# EAGLE design KitchenLightsController (EAGLE 7.4.0)
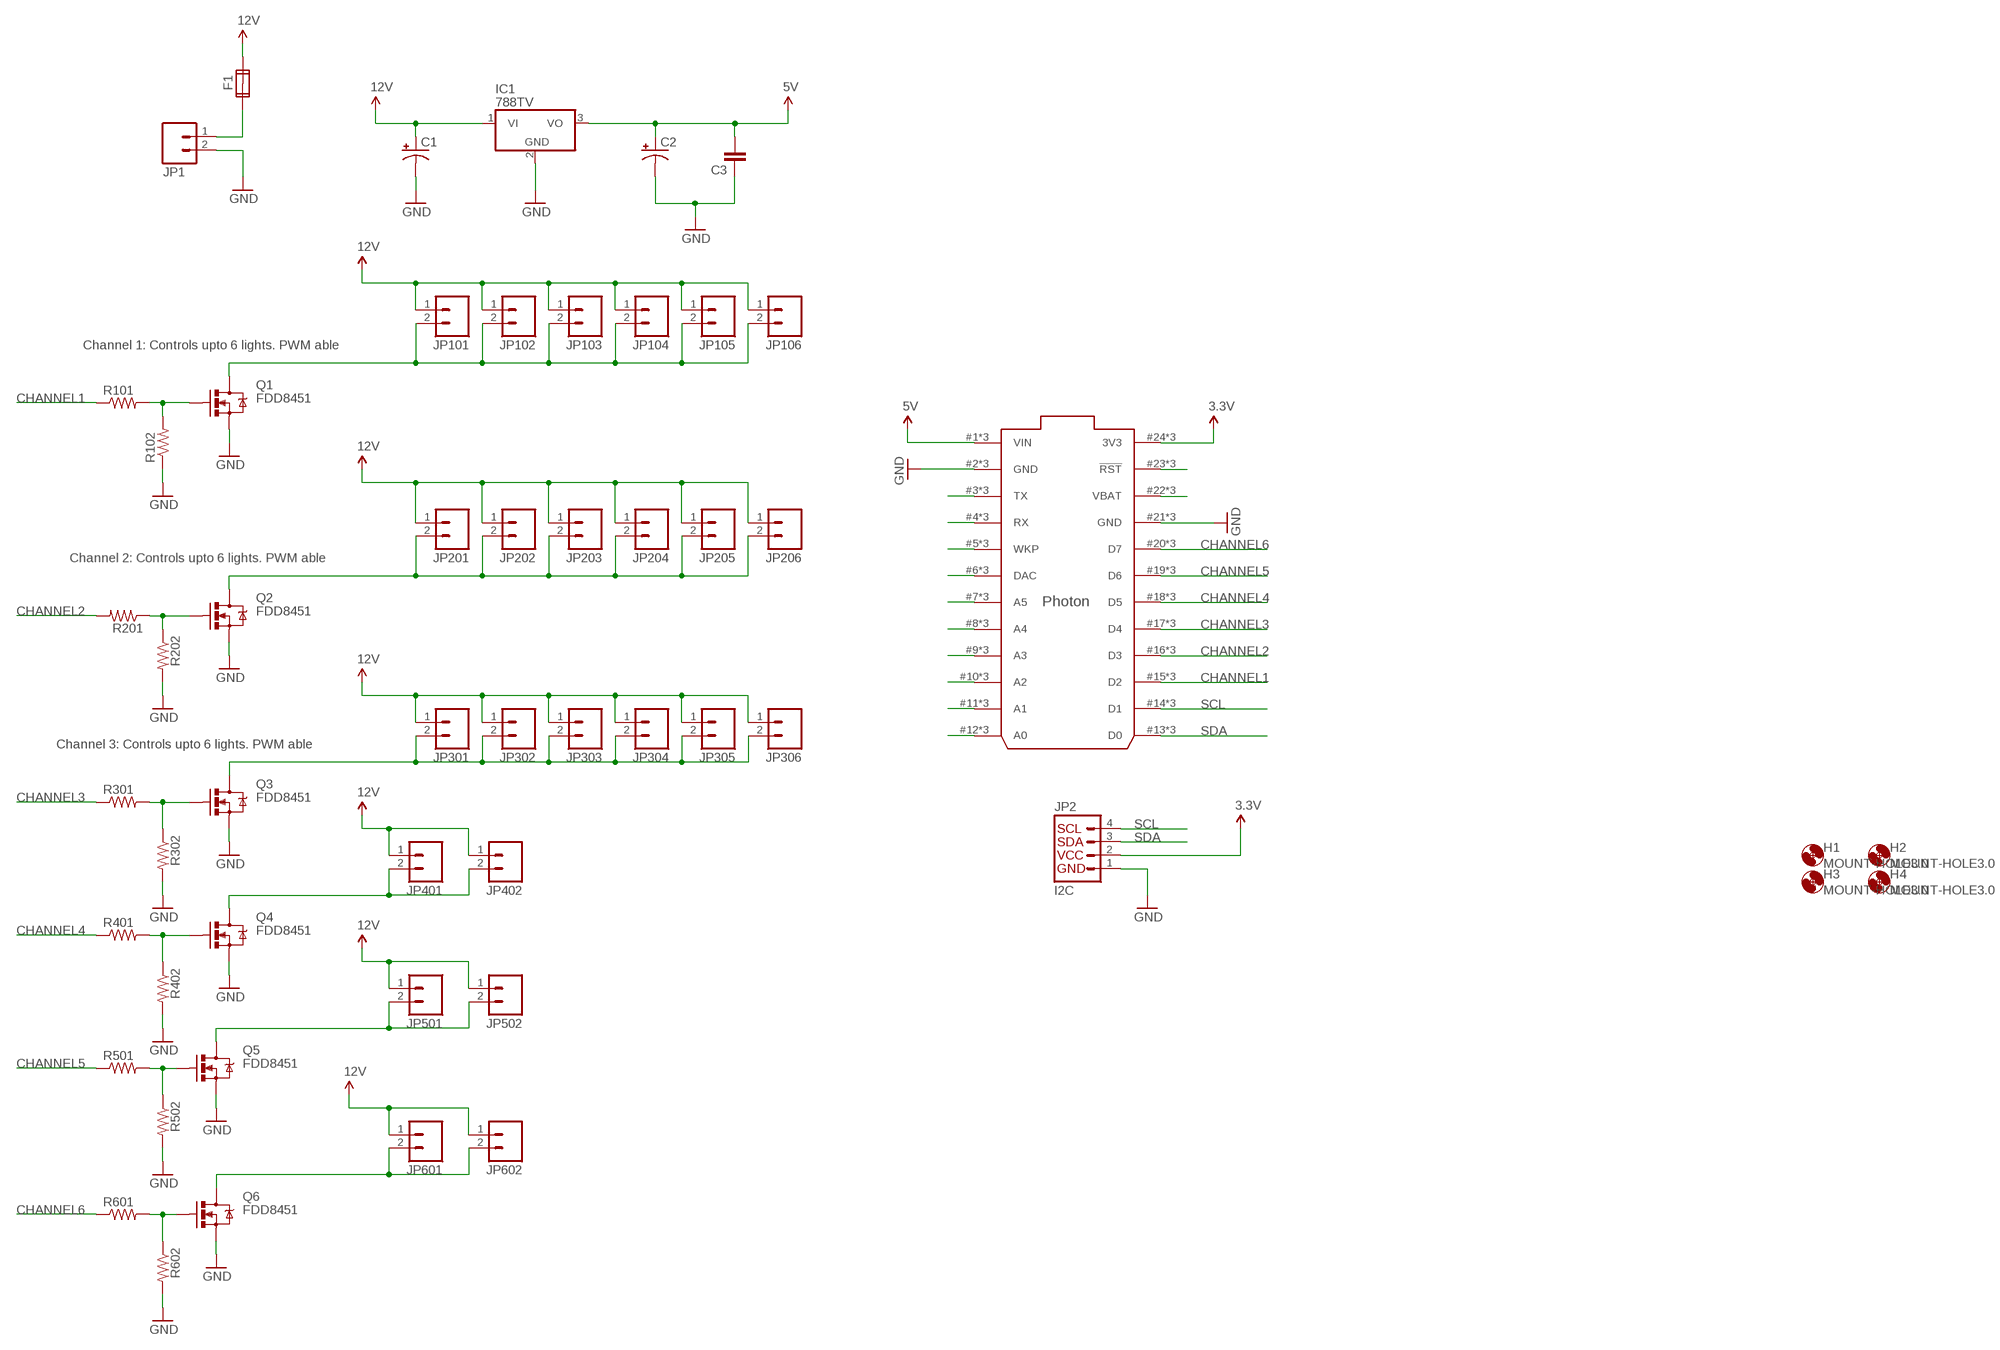
[diagram p0: schematic, sheet 1, part 1 of 2]
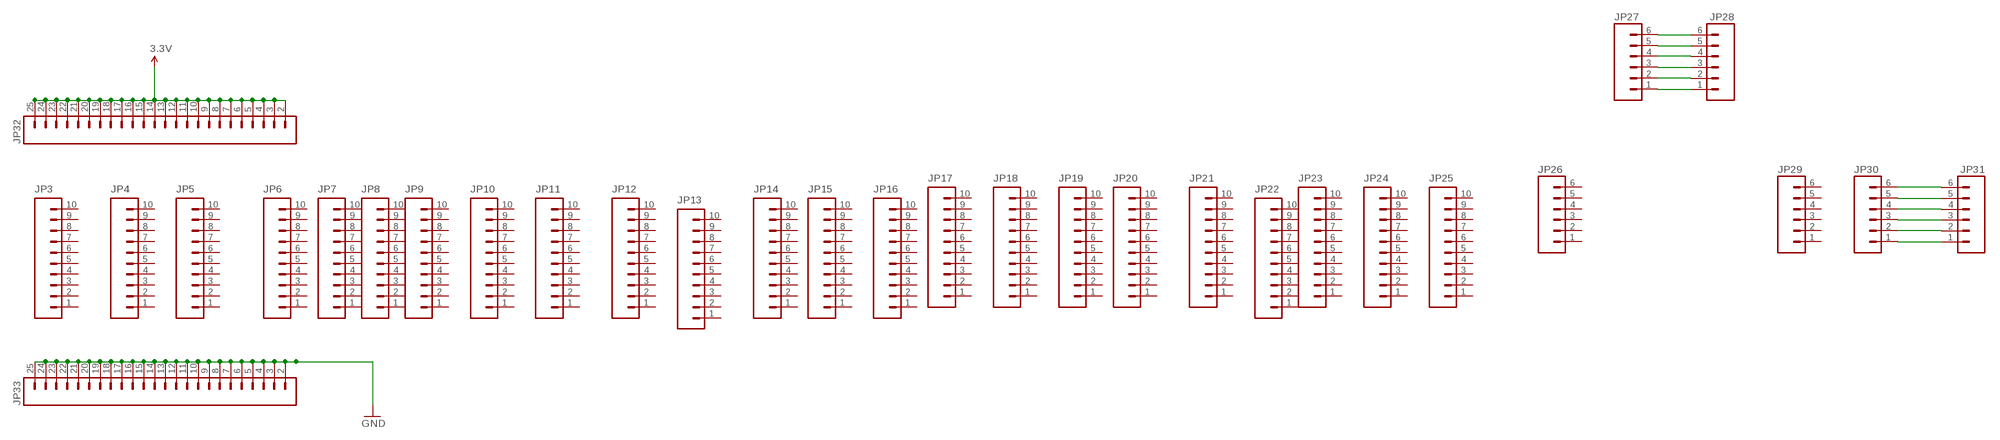
[diagram p1: schematic, sheet 1, part 2 of 2]

## Parts
C1  10UF-25V-20%(PTH)  [CPOL-RADIAL-10UF-25V]
C2  10UF-25V-20%(PTH)  [CPOL-RADIAL-10UF-25V]
C3  1UF-25V-10%(0805)"  [0805-CAP]
F1  FUSE2P  [FUSE1]
H1  MOUNT-HOLE3.0  [3,0]
H2  MOUNT-HOLE3.0  [3,0]
H3  MOUNT-HOLE3.0  [3,0]
H4  MOUNT-HOLE3.0  [3,0]
IC1  788TV  [TO220V]
JP1  M023.5MM  [SCREWTERMINAL-3.5MM-2]
JP2  I2C  I2C_STANDARD  [1X04]
JP3  M10NO_SILK_PTH_FEMALE  [1X10_NO_SILK]
JP4  M10NO_SILK_PTH_FEMALE  [1X10_NO_SILK]
JP5  M10NO_SILK_PTH_FEMALE  [1X10_NO_SILK]
JP6  M10NO_SILK_PTH_FEMALE  [1X10_NO_SILK]
JP7  M10NO_SILK_PTH_FEMALE  [1X10_NO_SILK]
JP8  M10NO_SILK_PTH_FEMALE  [1X10_NO_SILK]
JP9  M10NO_SILK_PTH_FEMALE  [1X10_NO_SILK]
JP10  M10NO_SILK_PTH_FEMALE  [1X10_NO_SILK]
JP11  M10NO_SILK_PTH_FEMALE  [1X10_NO_SILK]
JP12  M10NO_SILK_PTH_FEMALE  [1X10_NO_SILK]
JP13  M10NO_SILK_PTH_FEMALE  [1X10_NO_SILK]
JP14  M10NO_SILK_PTH_FEMALE  [1X10_NO_SILK]
JP15  M10NO_SILK_PTH_FEMALE  [1X10_NO_SILK]
JP16  M10NO_SILK_PTH_FEMALE  [1X10_NO_SILK]
JP17  M10NO_SILK_PTH_FEMALE  [1X10_NO_SILK]
JP18  M10NO_SILK_PTH_FEMALE  [1X10_NO_SILK]
JP19  M10NO_SILK_PTH_FEMALE  [1X10_NO_SILK]
JP20  M10NO_SILK_PTH_FEMALE  [1X10_NO_SILK]
JP21  M10NO_SILK_PTH_FEMALE  [1X10_NO_SILK]
JP22  M10NO_SILK_PTH_FEMALE  [1X10_NO_SILK]
JP23  M10NO_SILK_PTH_FEMALE  [1X10_NO_SILK]
JP24  M10NO_SILK_PTH_FEMALE  [1X10_NO_SILK]
JP25  M10NO_SILK_PTH_FEMALE  [1X10_NO_SILK]
JP26  M06NO_SILK_FEMALE_PTH  [1X06_NO_SILK]
JP27  M06NO_SILK_FEMALE_PTH  [1X06_NO_SILK]
JP28  M06NO_SILK_FEMALE_PTH  [1X06_NO_SILK]
JP29  M06NO_SILK_FEMALE_PTH  [1X06_NO_SILK]
JP30  M06NO_SILK_FEMALE_PTH  [1X06_NO_SILK]
JP31  M06NO_SILK_FEMALE_PTH  [1X06_NO_SILK]
JP32  M24  [1X24]
JP33  M24  [1X24]
JP101  M02POLAR  [MOLEX-1X2]
JP102  M02POLAR  [MOLEX-1X2]
JP103  M02POLAR  [MOLEX-1X2]
JP104  M02POLAR  [MOLEX-1X2]
JP105  M02POLAR  [MOLEX-1X2]
JP106  M02POLAR  [MOLEX-1X2]
JP201  M02POLAR  [MOLEX-1X2]
JP202  M02POLAR  [MOLEX-1X2]
JP203  M02POLAR  [MOLEX-1X2]
JP204  M02POLAR  [MOLEX-1X2]
JP205  M02POLAR  [MOLEX-1X2]
JP206  M02POLAR  [MOLEX-1X2]
JP301  M02POLAR  [MOLEX-1X2]
JP302  M02POLAR  [MOLEX-1X2]
JP303  M02POLAR  [MOLEX-1X2]
JP304  M02POLAR  [MOLEX-1X2]
JP305  M02POLAR  [MOLEX-1X2]
JP306  M02POLAR  [MOLEX-1X2]
JP401  M02POLAR  [MOLEX-1X2]
JP402  M023.5MM  [SCREWTERMINAL-3.5MM-2]
JP501  M02POLAR  [MOLEX-1X2]
JP502  M023.5MM  [SCREWTERMINAL-3.5MM-2]
JP601  M02POLAR  [MOLEX-1X2]
JP602  M023.5MM  [SCREWTERMINAL-3.5MM-2]
Q1  FDD8451  MOSFET-NCHANNELFDD8780  [DPAK]
Q2  FDD8451  MOSFET-NCHANNELFDD8780  [DPAK]
Q3  FDD8451  MOSFET-NCHANNELFDD8780  [DPAK]
Q4  FDD8451  MOSFET-NCHANNELFDD8780  [DPAK]
Q5  FDD8451  MOSFET-NCHANNELFDD8780  [DPAK]
Q6  FDD8451  MOSFET-NCHANNELFDD8780  [DPAK]
R101  RESISTOR0805-RES  [0805]
R102  RESISTOR0805-RES  [0805]
R201  RESISTOR0805-RES  [0805]
R202  RESISTOR0805-RES  [0805]
R301  RESISTOR0805-RES  [0805]
R302  RESISTOR0805-RES  [0805]
R401  RESISTOR0805-RES  [0805]
R402  RESISTOR0805-RES  [0805]
R501  RESISTOR0805-RES  [0805]
R502  RESISTOR0805-RES  [0805]
R601  RESISTOR0805-RES  [0805]
R602  RESISTOR0805-RES  [0805]
U$1  PHOTON_WITH_STACKABLE_HEADERS  [PHOTON_STACKABLE]

## Nets
3.3V: JP2.2 JP32.2 JP32.3 JP32.4 JP32.5 JP32.6 JP32.7 JP32.8 JP32.9 JP32.10 JP32.11 JP32.12 JP32.13 JP32.14 JP32.15 JP32.16 JP32.17 JP32.18 JP32.19 JP32.20 JP32.21 JP32.22 JP32.23 JP32.24 JP32.25 U$1.24(3V3) U$1.#24(3V3) U$1.@24(3V3)
5V: C2.1(+) C3.2 IC1.3(VO) U$1.1(VIN) U$1.#1(VIN) U$1.@1(VIN)
12V: C1.1(+) F1.2A IC1.1(VI) JP101.1 JP102.1 JP103.1 JP104.1 JP105.1 JP106.1 JP201.1 JP202.1 JP203.1 JP204.1 JP205.1 JP206.1 JP301.1 JP302.1 JP303.1 JP304.1 JP305.1 JP306.1 JP401.1 JP402.1 JP501.1 JP502.1 JP601.1 JP602.1
CHANNEL1: R101.1 U$1.15(D2) U$1.#15(D2) U$1.@15(D2)
CHANNEL2: R201.2 U$1.16(D3) U$1.#16(D3) U$1.@16(D3)
CHANNEL3: R301.1 U$1.17(D4) U$1.#17(D4) U$1.@17(D4)
CHANNEL4: R401.1 U$1.18(D5) U$1.#18(D5) U$1.@18(D5)
CHANNEL5: R501.1 U$1.19(D6) U$1.#19(D6) U$1.@19(D6)
CHANNEL6: R601.1 U$1.20(D7) U$1.#20(D7) U$1.@20(D7)
GND: C1.2(-) C2.2(-) C3.1 IC1.2(GND) JP1.2 JP2.1 JP33.2 JP33.3 JP33.4 JP33.5 JP33.6 JP33.7 JP33.8 JP33.9 JP33.10 JP33.11 JP33.12 JP33.13 JP33.14 JP33.15 JP33.16 JP33.17 JP33.18 JP33.19 JP33.20 JP33.21 JP33.22 JP33.23 JP33.24 JP33.25 Q1.3(S) Q2.3(S) Q3.3(S) Q4.3(S) Q5.3(S) Q6.3(S) R102.1 R202.2 R302.2 R402.2 R502.2 R602.2 U$1.2(GND) U$1.21(GND) U$1.#2(GND) U$1.#21(GND) U$1.@2(GND) U$1.@21(GND)
N$1: Q1.1(G) R101.2 R102.2
N$2: Q2.1(G) R201.1 R202.1
N$3: Q3.1(G) R301.2 R302.1
N$4: Q4.1(G) R401.2 R402.1
N$5: U$1.23(!RST) U$1.#23(!RST) U$1.@23(!RST)
N$6: U$1.22(VBAT) U$1.#22(VBAT) U$1.@22(VBAT)
N$7: Q5.1(G) R501.2 R502.1
N$8: Q6.1(G) R601.2 R602.1
N$9: JP201.2 JP202.2 JP203.2 JP204.2 JP205.2 JP206.2 Q2.4(D)
N$10: JP101.2 JP102.2 JP103.2 JP104.2 JP105.2 JP106.2 Q1.4(D)
N$11: F1.1A JP1.1
N$14: JP27.1 JP28.1
N$15: U$1.12(A0) U$1.#12(A0) U$1.@12(A0)
N$16: U$1.11(A1) U$1.#11(A1) U$1.@11(A1)
N$17: U$1.10(A2) U$1.#10(A2) U$1.@10(A2)
N$18: U$1.9(A3) U$1.#9(A3) U$1.@9(A3)
N$19: U$1.8(A4) U$1.#8(A4) U$1.@8(A4)
N$20: U$1.7(A5) U$1.#7(A5) U$1.@7(A5)
N$21: U$1.6(DAC) U$1.#6(DAC) U$1.@6(DAC)
N$22: U$1.5(WKP) U$1.#5(WKP) U$1.@5(WKP)
N$23: U$1.4(RX) U$1.#4(RX) U$1.@4(RX)
N$24: U$1.3(TX) U$1.#3(TX) U$1.@3(TX)
N$25: JP27.2 JP28.2
N$26: JP27.3 JP28.3
N$27: JP27.4 JP28.4
N$28: JP301.2 JP302.2 JP303.2 JP304.2 JP305.2 JP306.2 Q3.4(D)
N$29: JP27.5 JP28.5
N$30: JP401.2 JP402.2 Q4.4(D)
N$31: JP501.2 JP502.2 Q5.4(D)
N$32: JP601.2 JP602.2 Q6.4(D)
N$33: JP27.6 JP28.6
N$34: JP30.1 JP31.1
N$35: JP30.2 JP31.2
N$36: JP30.3 JP31.3
N$37: JP30.4 JP31.4
N$38: JP30.5 JP31.5
N$39: JP30.6 JP31.6
SCL: JP2.4 U$1.14(D1) U$1.#14(D1) U$1.@14(D1)
SDA: JP2.3 U$1.13(D0) U$1.#13(D0) U$1.@13(D0)
Unconnected: F1.1B F1.2B JP3.1 JP3.2 JP3.3 JP3.4 JP3.5 JP3.6 JP3.7 JP3.8 JP3.9 JP3.10 JP4.1 JP4.2 JP4.3 JP4.4 JP4.5 JP4.6 JP4.7 JP4.8 JP4.9 JP4.10 JP5.1 JP5.2 JP5.3 JP5.4 JP5.5 JP5.6 JP5.7 JP5.8 JP5.9 JP5.10 JP6.1 JP6.2 JP6.3 JP6.4 JP6.5 JP6.6 JP6.7 JP6.8 JP6.9 JP6.10 JP7.1 JP7.2 JP7.3 JP7.4 JP7.5 JP7.6 JP7.7 JP7.8 JP7.9 JP7.10 JP8.1 JP8.2 JP8.3 JP8.4 JP8.5 JP8.6 JP8.7 JP8.8 JP8.9 JP8.10 JP9.1 JP9.2 JP9.3 JP9.4 JP9.5 JP9.6 JP9.7 JP9.8 JP9.9 JP9.10 JP10.1 JP10.2 JP10.3 JP10.4 JP10.5 JP10.6 JP10.7 JP10.8 JP10.9 JP10.10 JP11.1 JP11.2 JP11.3 JP11.4 JP11.5 JP11.6 JP11.7 JP11.8 JP11.9 JP11.10 JP12.1 JP12.2 JP12.3 JP12.4 JP12.5 JP12.6 JP12.7 JP12.8 JP12.9 JP12.10 JP13.1 JP13.2 JP13.3 JP13.4 JP13.5 JP13.6 JP13.7 JP13.8 JP13.9 JP13.10 JP14.1 JP14.2 JP14.3 JP14.4 JP14.5 JP14.6 JP14.7 JP14.8 JP14.9 JP14.10 JP15.1 JP15.2 JP15.3 JP15.4 JP15.5 JP15.6 JP15.7 JP15.8 JP15.9 JP15.10 JP16.1 JP16.2 JP16.3 JP16.4 JP16.5 JP16.6 JP16.7 JP16.8 JP16.9 JP16.10 JP17.1 JP17.2 JP17.3 JP17.4 JP17.5 JP17.6 JP17.7 JP17.8 JP17.9 JP17.10 JP18.1 JP18.2 JP18.3 JP18.4 JP18.5 JP18.6 JP18.7 JP18.8 JP18.9 JP18.10 JP19.1 JP19.2 JP19.3 JP19.4 JP19.5 JP19.6 JP19.7 JP19.8 JP19.9 JP19.10 JP20.1 JP20.2 JP20.3 JP20.4 JP20.5 JP20.6 JP20.7 JP20.8 JP20.9 JP20.10 JP21.1 JP21.2 JP21.3 JP21.4 JP21.5 JP21.6 JP21.7 JP21.8 JP21.9 JP21.10 JP22.1 JP22.2 JP22.3 JP22.4 JP22.5 JP22.6 JP22.7 JP22.8 JP22.9 JP22.10 JP23.1 JP23.2 JP23.3 JP23.4 JP23.5 JP23.6 JP23.7 JP23.8 JP23.9 JP23.10 JP24.1 JP24.2 JP24.3 JP24.4 JP24.5 JP24.6 JP24.7 JP24.8 JP24.9 JP24.10 JP25.1 JP25.2 JP25.3 JP25.4 JP25.5 JP25.6 JP25.7 JP25.8 JP25.9 JP25.10 JP26.1 JP26.2 JP26.3 JP26.4 JP26.5 JP26.6 JP29.1 JP29.2 JP29.3 JP29.4 JP29.5 JP29.6

## Notes on the sheet
- Channel 1: Controls upto 6 lights. PWM able
- Channel 2: Controls upto 6 lights. PWM able
- Channel 3: Controls upto 6 lights. PWM able

## Library data of the parts
C1 C2 = SparkFun-Capacitors:10UF-25V-20%(PTH): CAP-08440; PROD_ID: CAP-08440
C3 = SparkFun-Capacitors:1UF-25V-10%(0805): CAP-08064
F1 = special:FUSE2P: FUSE 5 x 20 mm
H1-H4 = holes:MOUNT-HOLE: MOUNTING HOLE with drill center marker
IC1 = linear:78*: Positive VOLTAGE REGULATOR Source: http://cache.national.com/ds/LM/LM78L05.pdf http://www.fairchildsemi.com/ds/LM/LM7805.pdf
JP1 JP402 JP502 JP602 = SparkFun-Connectors:M02: Standard 2-pin 0.1" header. Use with - straight break away headers ( PRT-00116) - right angle break away headers (PRT-00553) - swiss pins (PRT-00743) - machine pins (PRT-00117) - female headers (PRT-00115) Molex polarized connector foot print use with: PRT-08233 with associated crimp pins and housings. 2.54_SCREWTERM for use with PRT-10571. 3.5mm Screw Terminal footprints for PRT-08084 5mm Screw Terminal footprints for use with PRT-08432; PROD_ID: CONN-08399
JP2 = SparkFun-Connectors:I2C_STANDARD: SparkFun has standardized on a pinout for all I2C based sensor breakouts. This pinout allows I2C boards to be plugged directly into the headers on Arduino Uno compatible boards, and to be daisy chained easily.
JP3-JP25 = SparkFun-Connectors:M10: Header 10 Standard 10-pin 0.1" header. Use with straight break away headers (SKU : PRT-00116), right angle break away headers (PRT-00553), swiss pins (PRT-00743), machine pins (PRT-00117), and female headers (PRT-00115).; PROD_ID: CONN-11563
JP26-JP31 = SparkFun-Connectors:M06: Header 6 Standard 6-pin 0.1" header. Use with straight break away headers (SKU : PRT-00116), right angle break away headers (PRT-00553), swiss pins (PRT-00743), machine pins (PRT-00117), and female headers (PRT-00115). Molex polarized connector foot print use with SKU : PRT-08094 with associated crimp pins and housings. NOTES ON THE VARIANTS LOCK and LOCK_LONGPADS... This footprint was designed to help hold the alignment of a through-hole component (i.e. 6-pin header) while soldering it into place. You may notice that each hole has been shifted either up or down by 0.005 of an inch from it's more standard position (which is a perfectly straight line). This slight alteration caused the pins (the squares in the middle) to touch the edges of the holes. Because they are alternating, it causes a "brace" to hold the component in place. 0.005 has proven to be the perfect amount of "off-center" position when using our standard breakaway headers. Although looks a little odd when you look at the bare footprint, once you have a header in there, the alteration is very hard to notice. Also,if you push a header all the way into place, it is covered up entirely on the bottom side. This idea of altering the position of holes to aid alignment will be further integrated into the Sparkfun Library for other footprints. It can help hold any component with 3 or more connection pins.; PROD_ID: CONN-08437
JP32 JP33 = SparkFun-Connectors:M24: 1x24 .1" header
JP101-JP106 JP201-JP206 JP301-JP306 JP401 JP501 JP601 = SparkFun-Connectors:M02: Standard 2-pin 0.1" header. Use with - straight break away headers ( PRT-00116) - right angle break away headers (PRT-00553) - swiss pins (PRT-00743) - machine pins (PRT-00117) - female headers (PRT-00115) Molex polarized connector foot print use with: PRT-08233 with associated crimp pins and housings. 2.54_SCREWTERM for use with PRT-10571. 3.5mm Screw Terminal footprints for PRT-08084 5mm Screw Terminal footprints for use with PRT-08432
Q1-Q6 = SparkFun-DiscreteSemi:MOSFET-NCHANNEL: Common NMOSFET Parts MFG P/N Store ID Prod ID FDD8780 TRANS-09984 SI7820DN TRANS-11055 FDS6630A IC-08089 2N7002PW TRANS-11151 FQP30N06L COM-10213 TRANS-10060 BSS123LT1G TRANS-08345 BSS138 TRANS-00830 BS170 2N7000; PROD_ID: TRANS-09984
R101 R102 R201 R202 R301 R302 R401 R402 R501 R502 R601 R602 = SparkFun-Resistors:RESISTOR: Resistor Basic schematic elements and footprints for 0603, 1206, and PTH resistors.
U$1 = Particle:PHOTON

## Board
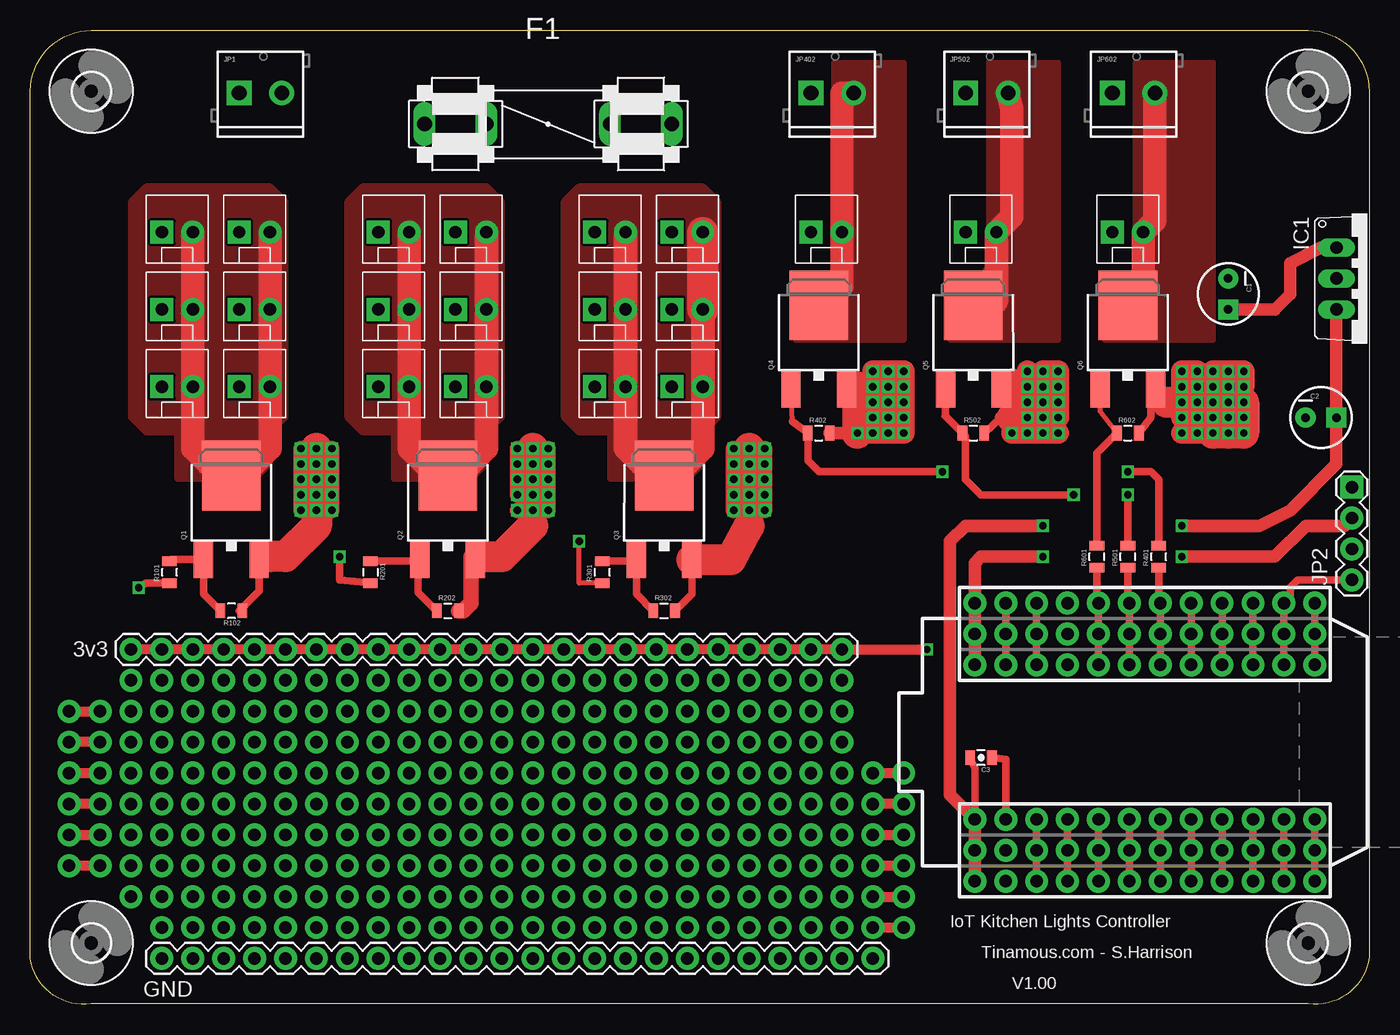
[diagram p2: board, top side]
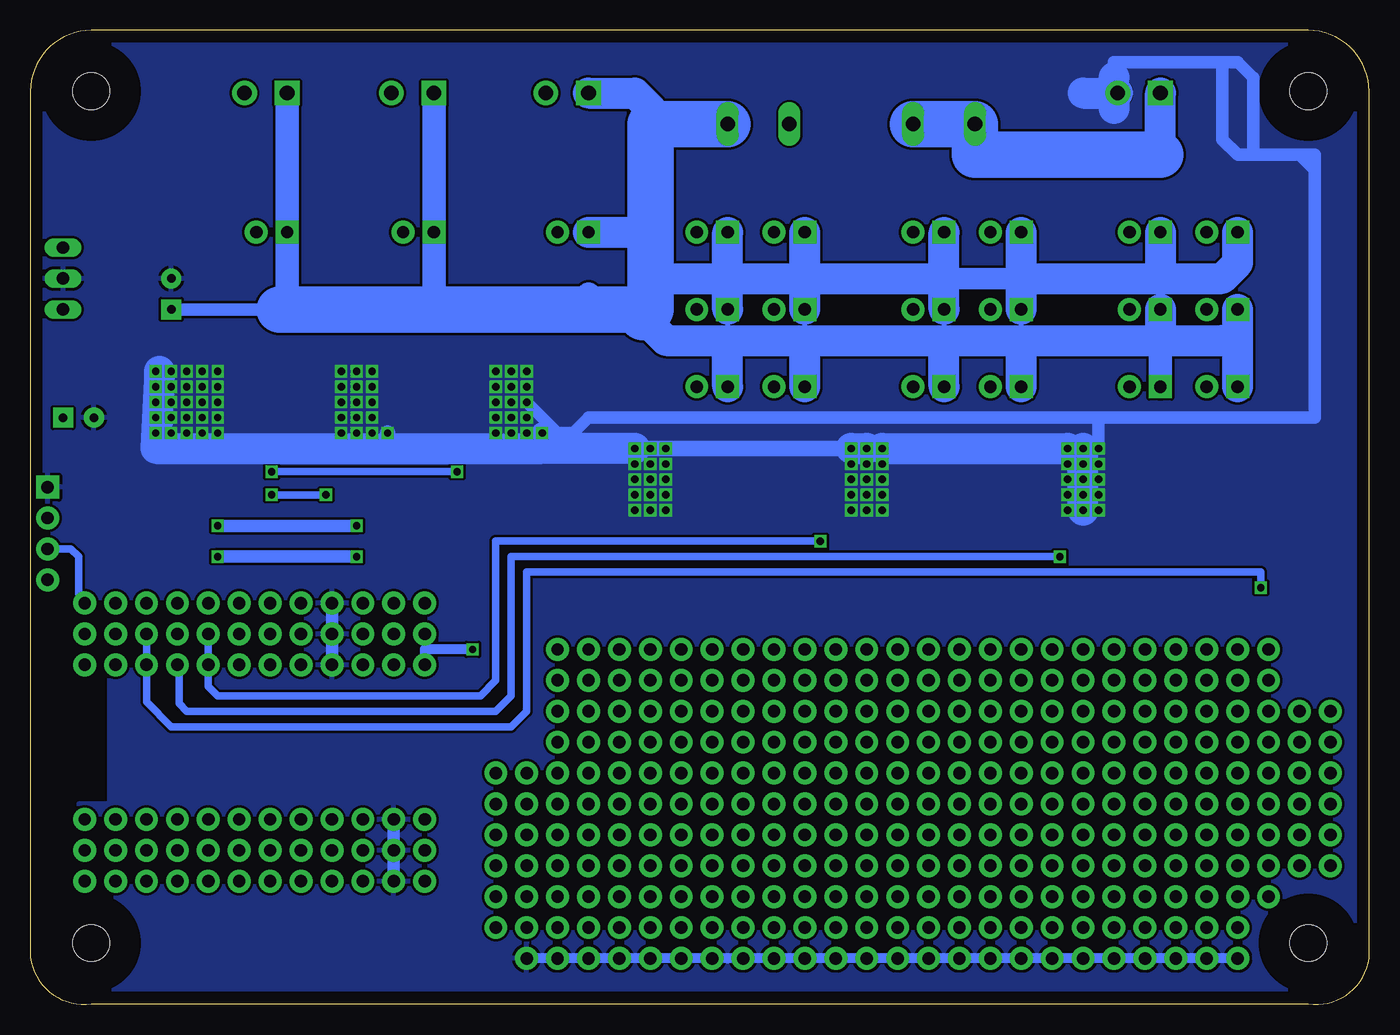
[diagram p3: board, bottom side, seen from below]

Size 110 x 80.04 mm. Coordinates in mm from the lower left corner, seen from the top.
Outline: 5,0.04 arc-90 0,3.77 0,75.04 arc-90 5,80.04 105,80.04 arc-90 110,75.04 110,3.85 arc-90 105,0.04 5,0.04
Copper layers (1*16): Top 0.035mm / dielectric 1.5mm / Bottom 0.035mm
Design rules "default": minimum track width 10mil, minimum drill 24mil, track to track 8mil, track to pad 8mil, pad to pad 8mil, via to via 8mil, smd to smd 8mil, copper to edge 40mil, drill to drill 8mil, minimum pad ring 10mil, minimum via ring 8mil, stop-mask expansion 4mil, vias tented up to drill 0mil, thermal gap 10mil

### Footprints (pad centres in the part's own frame; a part is rotated, then mirrored left to right if it is on the bottom)
CPOL-RADIAL-10UF-25V = drill 0.7 pad 1.651 square: 1 1.27,0 | drill 0.7 pad 1.651: 2 -1.27,0
0805-CAP = smd 0.8 x 1.2: 1 -0.9,0; 2 0.9,0
FUSE1 = drill 1.194 long: 1A -10.16,0; 1B -5.08,0; 2A 10.16,0; 2B 5.08,0
3,0 = hole 3: 0,0
TO220V = drill 1.016 long: 1 -2.54,-2.54; 2 0,-2.54; 3 2.54,-2.54
SCREWTERMINAL-3.5MM-2 = drill 1.2 pad 2.032 square: 1 0,0 | drill 1.2 pad 2.032: 2 3.5,0
1X04 = drill 1.016 pad 1.88 square: 1 0,0 | drill 1.016 pad 1.88: 2 2.54,0; 3 5.08,0; 4 7.62,0
1X10_NO_SILK = drill 1.016 pad 1.88: 1 0,0; 2 2.54,0; 3 5.08,0; 4 7.62,0; 5 10.16,0; 6 12.7,0; 7 15.24,0; 8 17.78,0; 9 20.32,0; 10 22.86,0
1X06_NO_SILK = drill 1.016 pad 1.88: 1 0,0; 2 2.54,0; 3 5.08,0; 4 7.62,0; 5 10.16,0; 6 12.7,0
1X24 = drill 1.016 pad 1.88: 2 -26.67,0; 3 -24.13,0; 4 -21.59,0; 5 -19.05,0; 6 -16.51,0; 7 -13.97,0; 8 -11.43,0; 9 -8.89,0; 10 -6.35,0; 11 -3.81,0; 12 -1.27,0; 13 1.27,0; 14 3.81,0; 15 6.35,0; 16 8.89,0; 17 11.43,0; 18 13.97,0; 19 16.51,0; 20 19.05,0; 21 21.59,0; 22 24.13,0; 23 26.67,0; 24 29.21,0; 25 31.75,0
MOLEX-1X2 = drill 1.016 pad 1.88 square: 1 0,0 | drill 1.016 pad 1.88: 2 2.54,0
DPAK = smd 1.6 x 3: 1 -2.28,-5.31; 3 2.28,-5.31 | smd 4.826 x 5.715: 4 0,1.588
0805 = smd 0.8 x 1.2: 1 -0.9,0; 2 0.9,0
PHOTON_STACKABLE = drill 1.016 pad 1.88: 1 1.27,32.258; 2 1.27,29.718; 3 1.27,27.178; 4 1.27,24.638; 5 1.27,22.098; 6 1.27,19.558; 7 1.27,17.018; 8 1.27,14.478; 9 1.27,11.938; 10 1.27,9.398; 11 1.27,6.858; 12 1.27,4.318; 13 19.05,4.318; 14 19.05,6.858; 15 19.05,9.398; 16 19.05,11.938; 17 19.05,14.478; 18 19.05,17.018; 19 19.05,19.558; 20 19.05,22.098; 21 19.05,24.638; 22 19.05,27.178; 23 19.05,29.718; 24 19.05,32.258; #1 3.81,32.258; #2 3.81,29.718; #3 3.81,27.178; #4 3.81,24.638; #5 3.81,22.098; #6 3.81,19.558; #7 3.81,17.018; #8 3.81,14.478; #9 3.81,11.938; #10 3.81,9.398; #11 3.81,6.858; #12 3.81,4.318; #13 21.59,4.318; #14 21.59,6.858; #15 21.59,9.398; #16 21.59,11.938; #17 21.59,14.478; #18 21.59,17.018; #19 21.59,19.558; #20 21.59,22.098; #21 21.59,24.638; #22 21.59,27.178; #23 21.59,29.718; #24 21.59,32.258; @1 -1.27,32.258; @2 -1.27,29.718; @3 -1.27,27.178; @4 -1.27,24.638; @5 -1.27,22.098; @6 -1.27,19.558; @7 -1.27,17.018; @8 -1.27,14.478; @9 -1.27,11.938; @10 -1.27,9.398; @11 -1.27,6.858; @12 -1.27,4.318; @13 16.51,4.318; @14 16.51,6.858; @15 16.51,9.398; @16 16.51,11.938; @17 16.51,14.478; @18 16.51,17.018; @19 16.51,19.558; @20 16.51,22.098; @21 16.51,24.638; @22 16.51,27.178; @23 16.51,29.718; @24 16.51,32.258

### Placement (x,y rotation side)
C1  98.43,58.38 270 top
C2  106.05,48.22 0 top
C3  78.11,20.28 180 top
F1  42.55,72.35 0 top
H1  5,5.04 0 top
H2  105,5.04 0 top
H3  105,75.04 0 top
H4  5,75.04 0 top
IC1  109.86,59.65 270 top
JP1  17.15,74.89 0 top
JP2  108.59,42.51 270 top
JP3  66.68,3.77 90 top
JP4  64.14,3.77 90 top
JP5  61.6,3.77 90 top
JP6  59.06,3.77 90 top
JP7  56.52,3.77 90 top
JP8  53.98,3.77 90 top
JP9  51.44,3.77 90 top
JP10  48.9,3.77 90 top
JP11  46.36,3.77 90 top
JP12  43.82,3.77 90 top
JP13  41.28,3.77 90 top
JP14  38.74,3.77 90 top
JP15  36.2,3.77 90 top
JP16  33.66,3.77 90 top
JP17  31.12,3.77 90 top
JP18  28.58,3.77 90 top
JP19  26.04,3.77 90 top
JP20  23.5,3.77 90 top
JP21  20.96,3.77 90 top
JP22  18.42,3.77 90 top
JP23  15.88,3.77 90 top
JP24  13.34,3.77 90 top
JP25  10.8,3.77 90 top
JP26  8.26,8.85 90 top
JP27  5.72,11.39 90 top
JP28  3.18,11.39 90 top
JP29  8.26,13.93 90 top
JP30  71.76,6.31 90 top
JP31  69.22,6.31 90 top
JP32  34.93,29.17 0 top
JP33  37.47,3.77 0 top
JP101  10.8,50.76 0 top
JP102  10.8,57.11 0 top
JP103  10.8,63.46 0 top
JP104  17.15,50.76 0 top
JP105  17.15,57.11 0 top
JP106  17.15,63.46 0 top
JP201  28.58,50.76 0 top
JP202  28.58,57.11 0 top
JP203  28.58,63.46 0 top
JP204  34.93,50.76 0 top
JP205  34.93,57.11 0 top
JP206  34.93,63.46 0 top
JP301  46.36,50.76 0 top
JP302  46.36,57.11 0 top
JP303  46.36,63.46 0 top
JP304  52.71,50.76 0 top
JP305  52.71,57.11 0 top
JP306  52.71,63.46 0 top
JP401  64.14,63.46 0 top
JP402  64.14,74.89 0 top
JP501  76.84,63.46 0 top
JP502  76.84,74.89 0 top
JP601  88.91,63.46 0 top
JP602  88.91,74.89 0 top
Q1  16.52,41.87 0 top
Q2  34.29,41.87 0 top
Q3  52.07,41.87 0 top
Q4  64.78,55.84 0 top
Q5  77.48,55.84 0 top
Q6  90.18,55.84 0 top
R101  11.43,35.52 90 top
R102  16.52,32.35 180 top
R201  27.95,35.52 270 top
R202  34.29,32.35 0 top
R301  46.99,35.52 90 top
R302  52.07,32.35 0 top
R401  92.72,36.79 90 top
R402  64.78,46.95 0 top
R501  90.18,36.79 90 top
R502  77.48,46.95 0 top
R601  87.64,36.79 90 top
R602  90.18,46.95 0 top
U$1  109.86,11.39 90 top

### Tracks (layer width: path | path; a pad name or v marks a point on that pad's centre or on a via)
3.3V  (via drill 0.6)
  Top 0.813: JP32.2 JP32.3 JP32.4 JP32.5 JP32.6 JP32.7 JP32.8 JP32.9 JP32.10 JP32.11 JP32.12 JP32.13 JP32.14 JP32.15 JP32.16 JP32.17 JP32.18 JP32.19 JP32.20 JP32.21 JP32.22 JP32.23 JP32.24 JP32.25 v73.67,29.17
  Top 1.016: U$1.@24 U$1.24 U$1.#24 77.6,36.28 78.11,36.79 v83.19,36.79 | v94.62,36.79 102.24,36.79 104.78,39.33 107.95,39.33 JP2.2
  Bottom 0.813: v73.67,29.17 77.6,29.17 U$1.@24
  Bottom 1.016: v83.19,36.79 v94.62,36.79
5V  (via drill 0.6)
  Top 0.61: U$1.#1 77.6,19.4 C3.2
  Top 1.016: U$1.@1 U$1.1 U$1.#1 75.57,17.23 75.57,38.06 76.84,39.33 v83.19,39.33 | IC1.3 C2.1 107.32,44.41 103.51,40.6 100.97,39.33 v94.62,39.33
  Bottom 1.016: v94.62,39.33 v83.19,39.33
12V
  Top 1.016: IC1.1 106.05,62.19 103.51,60.92 103.51,58.38 102.24,57.11 C1.1
  Bottom 1.016: C1.1 89.54,57.11
  Bottom 1.778: 34.93,59.65 28.58,59.65 | 12.07,54.57 10.8,55.84 JP102.1
  Bottom 1.93: JP104.1 17.15,54.57 | JP601.1 JP602.1 88.91,57.75 89.54,57.11 | JP502.1 JP501.1 76.84,57.11 | 64.14,58.38 62.87,57.11 | 62.87,57.11 60.33,57.11 | 73.03,57.11 62.87,57.11
  Bottom 2.54: 52.71,59.65 57.79,59.65 60.33,57.11 59.7,56.48 57.79,54.57 52.71,54.57 | 52.71,59.65 46.36,59.65 | 46.36,59.65 34.93,59.65 | 28.58,59.65 17.15,59.65 | 17.15,59.65 12.07,59.65 10.8,60.92 JP103.1 | 52.71,54.57 46.36,54.57 | 46.36,54.57 34.93,54.57 | 34.93,54.57 28.58,54.57 | 28.58,54.57 17.15,54.57 | 17.15,54.57 12.07,54.57 | JP305.1 52.71,59.65 | 52.71,59.65 JP306.1 | JP302.1 46.36,59.65 | 46.36,59.65 JP303.1 | JP205.1 34.93,59.65 | JP202.1 28.58,59.65 | 34.93,59.65 JP206.1 | 28.58,59.65 JP203.1 | JP106.1 17.15,59.65 | JP105.1 17.15,54.57 | JP101.1 JP102.1 | JP201.1 28.58,54.57 | JP301.1 46.36,54.57 | JP304.1 52.71,54.57 | JP204.1 34.93,54.57 | JP402.1 60.33,74.89 59.06,73.62 59.06,72.35 | JP401.1 59.06,63.46
  Bottom 3.81: 89.54,57.11 76.84,57.11 60.33,57.11 | F1.2A 59.06,72.35 59.06,63.46 59.06,57.11 59.7,56.48
CHANNEL1  (via drill 0.6)
  Top 0.61: U$1.@15 U$1.15 U$1.#15 | R101.1 9.53,34.62 v8.89,34.25
  Bottom 0.61: U$1.15 100.46,24.85 98.43,22.82 70.49,22.82 69.22,24.09 69.22,35.52 8.89,35.52 v8.89,34.25
CHANNEL2  (via drill 0.6)
  Top 0.61: U$1.#16 U$1.16 U$1.@16 | R201.2 25.41,34.89 v25.41,36.79
  Bottom 0.61: v25.41,36.79 70.49,36.79 70.49,25.36 71.76,24.09 97.16,24.09 97.8,24.73 97.8,27.78 U$1.@16
CHANNEL3  (via drill 0.6)
  Top 0.406: R301.1 45.09,34.62 v45.09,38.06
  Top 0.61: U$1.@17 U$1.17 U$1.#17
  Bottom 0.61: U$1.17 95.38,26.12 94.62,25.36 73.03,25.36 71.76,26.63 71.76,38.06 v45.09,38.06
CHANNEL4
  Top 0.61: U$1.@18 U$1.18 U$1.#18 92.72,33.11 R401.1
CHANNEL5
  Top 0.61: U$1.@19 U$1.19 U$1.#19 90.18,33.11 R501.1
CHANNEL6
  Top 0.61: U$1.@20 U$1.20 U$1.#20 87.64,33.11 R601.1
GND  (via drill 0.6)
  Top 0.406: Q1.3 18.8,35.52 | 17.15,32.35 R102.1 | Q2.3 36.57,33.73 R202.2 | 92.08,50.16 Q6.3
  Top 0.61: 18.8,35.52 18.8,33.99 17.15,32.35 | Q3.3 54.35,33.73 R302.2 | R502.2 79.76,48.22 | R402.2 67.58,47.25 | R602.2 92.08,48.22 92.08,50.16 | U$1.#2 80.14,20.14 C3.1
  Top 1.016: v69.22,52.03 v69.22,50.76 | v71.76,50.76 v71.76,49.49 | v95.89,52.03 v95.89,50.76 | v94.62,46.95 v94.62,48.22 | v95.89,48.22 v97.16,48.22 | 80.65,51.4 80.62,51.4 Q5.3 | 80.65,48.22 79.76,48.22 | 67.58,47.25 67.88,46.95 v67.95,46.95 R402.2 | v69.22,49.49 67.95,49.49
  Top 1.27: 19.69,36.79 18.8,35.52 | Q6.3 92.45,50.39 93.35,49.49 | Q4.3 67.72,50.53 | 59.06,39.33 v59.06,40.6 v59.06,41.87 v59.06,43.14 v59.06,44.41 | R202.2 35.56,32.35 36.2,32.98 36.2,36.79 37.47,36.79 | 41.28,39.33 v41.28,40.6 v40.01,40.6 | v42.55,45.68 v42.55,44.41 v42.55,43.14 v42.55,41.87 v42.55,40.6 | v24.77,45.68 v24.77,44.41 v24.77,43.14 v24.77,41.87 v24.77,40.6 | v57.79,45.68 v57.79,44.41 v57.79,43.14 v57.79,41.87 v57.79,40.6 | v23.5,40.6 v22.23,40.6 v22.23,41.87 v22.23,43.14 v22.23,44.41 v22.23,45.68 | v40.01,45.68 v40.01,44.41 v40.01,43.14 v40.01,41.87 | v60.33,45.68 v60.33,44.41 v60.33,43.14 v60.33,41.87 v60.33,40.6
  Top 1.778: v98.43,49.49 v97.16,49.49 v95.89,49.49 v94.62,49.49 v94.62,50.76 v94.62,52.03 v95.89,52.03 | v98.43,49.49 v99.7,49.49 | v97.16,46.95 v95.89,46.95 v94.62,46.95 | v81.92,52.03 v81.92,50.76 v81.92,49.49 v81.92,48.22 v80.65,46.95 v81.92,46.95 v83.19,46.95 | v67.95,46.95 v69.22,46.95 v70.49,46.95 v71.76,46.95 v71.76,48.22 | v71.76,48.22 v71.76,52.03 v70.49,52.03 | v71.76,48.22 v70.49,48.22 v70.49,49.49 v70.49,50.76 | v70.49,50.76 v70.49,52.03 | v70.49,52.03 v69.22,52.03 | v69.22,50.76 v69.22,49.49 v69.22,48.22 | v70.49,50.76 v71.76,50.76 | v83.19,46.95 v83.19,48.22 v83.19,49.49 v83.19,50.76 v83.19,52.03 v84.46,52.03 v84.46,50.76 v84.46,49.49 v84.46,48.22 v83.19,46.95 | v95.89,50.76 v97.16,50.76 v97.16,52.03 v98.43,52.03 v99.7,52.03 v99.7,50.76 v98.43,50.76 | v94.62,48.22 v95.89,48.22 | v97.16,48.22 v98.43,48.22 | v99.7,48.22 v98.43,48.22 | v98.43,49.49 v98.43,48.22 | v83.19,46.95 v84.46,46.95 | 80.65,48.22 80.65,51.4
  Top 2.54: v23.5,45.68 v23.5,44.41 v23.5,43.14 v23.5,41.87 v23.5,40.6 23.5,39.33 20.96,36.79 19.69,36.79 | 93.35,49.49 v94.62,49.49 | v99.7,49.49 v99.7,48.22 v99.7,46.95 v98.43,46.95 v97.16,46.95 | 80.65,48.22 v81.92,48.22 | 67.72,50.53 67.95,50.76 67.95,49.49 v67.95,46.95 | Q3.3 57.56,36.56 59.06,39.33 | v59.06,44.41 v59.06,45.68 | 37.47,36.79 38.74,36.79 41.28,39.33 | v41.28,40.6 v41.28,41.87 v41.28,43.14 v41.28,44.41 v41.28,45.68
  Bottom 0.813: JP33.2 JP33.3 JP33.4 JP33.5 JP33.6 JP33.7 JP33.8 JP33.9 JP33.10 JP33.11 JP33.12 JP33.13 JP33.14 JP33.15 JP33.16 JP33.17 JP33.18 | JP33.18 52.71,3.77 | JP33.18 JP33.19 JP33.20 JP33.21 JP33.22 JP33.23 JP33.24 JP33.25
  Bottom 1.016: U$1.#2 U$1.2 U$1.@2 | U$1.#21 U$1.21 U$1.@21 | v22.23,45.68 22.23,48.22 4.45,48.22 4.45,68.54 | 4.45,68.54 5.72,69.81 9.53,69.81 9.53,76.16 10.8,77.43 12.07,77.43 | 20.96,74.89 20.96,77.43 12.07,77.43 | 12.07,77.43 12.07,71.08 10.8,69.81 4.45,69.81 4.45,68.54 | 9.53,48.22 64.14,48.22 65.41,46.95 66.68,46.95 v69.22,49.49
  Bottom 1.27: v42.55,45.68 v57.79,45.68 v59.06,45.68 v60.33,45.68 | v41.28,45.68 v40.01,45.68 | v24.77,45.68 v23.5,45.68 | v80.65,46.95 80.65,45.68
  Bottom 1.778: v67.95,46.95 67.95,45.68
  Bottom 1.93: v99.7,52.03 v99.7,46.95 99.7,45.68
  Bottom 2.54: 99.39,52.03 99.7,45.68 80.65,45.68 67.95,45.68 v60.33,45.68 | v42.55,45.68 v41.28,45.68 | v40.01,45.68 v24.77,45.68 | v23.5,40.6 v23.5,41.87 v23.5,43.14 v23.5,44.41 v23.5,45.68 | 20.96,74.89 20.96,76.16 | 20.96,74.89 20.96,73.62 | JP1.2 20.96,74.89 | 23.5,74.89 20.96,74.89
  pour Bottom: -0.55,81.24 111.13,81.24 111.13,30.52 106.05,30.52 106.05,27.27 103.51,27.27 103.51,16.47 106.05,16.47 106.05,12.03 111.13,12.03 111.13,-1.31 95.26,-1.31 92.72,-1.23 -0.55,-1.23
N$1
  Top 0.406: 11.57,36.56 R101.2
  Top 0.61: R102.2 14.23,33.73 Q1.1 11.57,36.56
N$2
  Top 0.406: Q2.1 31.88,36.42
  Top 0.61: R201.1 31.88,36.42 31.88,33.87 R202.1
N$3
  Top 0.61: R302.1 49.79,33.73 Q3.1 49.65,36.42 R301.2
N$4  (via drill 0.6)
  Top 0.406: 62.6,47.88 Q4.1
  Top 0.61: 62.6,47.88 R402.1 63.87,44.68 64.78,43.78 v74.94,43.78 | R401.2 92.72,43.14 92.08,43.78 v90.18,43.78
  Bottom 0.61: v90.18,43.78 v74.94,43.78
N$5
  Top 0.61: U$1.@23 U$1.23 U$1.#23
N$6
  Top 0.61: U$1.#22 U$1.22 U$1.@22
N$7  (via drill 0.6)
  Top 0.406: Q5.1 75.06,50.39 75.06,48.34
  Top 0.61: Q5.1 75.2,48.33 R502.1 76.84,46.69 76.84,43.14 78.11,41.87 v85.73,41.87 | R501.2 v90.18,41.87
  Bottom 0.61: v90.18,41.87 v85.73,41.87
N$8
  Top 0.406: Q6.1 87.9,48.75 R602.1
  Top 0.61: R601.2 87.64,45.31 R602.1
N$9
  Top 1.27: 34.93,44.41 34.29,41.87 Q2.4
  Top 1.93: 34.93,44.41 36.2,44.41 37.47,45.68 JP204.2 JP205.2 JP206.2 | Q2.4 33.34,44.41 32.39,44.41 31.12,45.68 JP201.2 JP202.2 JP203.2
  pour Top (no thermals): 26.04,66 27.31,67.27 37.47,67.27 38.74,66 38.74,48.22 37.47,46.95 37.47,44.41 36.2,43.14 29.85,43.14 29.85,46.95 27.31,46.95 26.04,48.22
N$10
  Top 1.27: Q1.4 16.77,43.97 17.02,44.48 17.15,44.73
  Top 1.93: 17.02,44.48 17.09,44.41 18.42,44.41 19.69,45.68 JP104.2 JP105.2 JP106.2 | 16.77,43.97 16.32,44.41 14.61,44.41 13.34,45.68 JP101.2 JP102.2 JP103.2
  pour Top (no thermals): 8.26,48.22 8.26,66 9.53,67.27 19.69,67.27 20.96,66 20.96,48.22 19.69,46.95 19.69,44.41 18.42,43.14 12.07,43.14 12.07,46.95 9.53,46.95
N$11
  Bottom 2.54: 17.15,69.81 JP1.1
  Bottom 3.81: 37.47,72.35 F1.1A 32.39,69.81 17.15,69.81
N$14
  Top 0.813: JP27.1 JP28.1
N$15
  Top 0.61: U$1.#12 U$1.12 U$1.@12
N$16
  Top 0.61: U$1.@11 U$1.11 U$1.#11
N$17
  Top 0.61: U$1.#10 U$1.10 U$1.@10
N$18
  Top 0.61: U$1.#9 U$1.9 U$1.@9
N$19
  Top 0.61: U$1.@8 U$1.8 U$1.#8
N$20
  Top 0.61: U$1.#7 U$1.7 U$1.@7
N$21
  Top 0.61: U$1.@6 U$1.6 U$1.#6
N$22
  Top 0.61: U$1.#5 U$1.5 U$1.@5
N$23
  Top 0.61: U$1.@4 U$1.4 U$1.#4
N$24
  Top 0.61: U$1.#3 U$1.3 U$1.@3
N$25
  Top 0.813: JP28.2 JP27.2
N$26
  Top 0.813: JP27.3 JP28.3
N$27
  Top 0.813: JP28.4 JP27.4
N$28
  Top 1.93: JP305.2 JP304.2 55.25,45.68 53.98,44.41 53.03,44.41 Q3.4 51.12,44.41 50.17,44.41 48.9,45.68 JP301.2 JP302.2 JP303.2
  Top 2.54: JP305.2 JP306.2
  pour Top (no thermals): 43.82,66 45.09,67.27 55.25,67.27 56.52,66 56.52,48.22 55.25,46.95 55.25,44.41 53.98,43.14 47.63,43.14 47.63,46.95 45.09,46.95 43.82,48.22
N$29
  Top 0.813: JP27.5 JP28.5
N$30
  Top 1.93: JP402.2 66.68,74.89 JP401.2 66.68,59.02 Q4.4
  pour Top (no thermals): 66.05,77.43 71.76,77.43 71.76,54.57 62.87,54.57 62.87,59.65 66.05,59.65
N$31
  Top 1.93: JP502.2 80.65,73.62 80.65,64.73 JP501.2 79.38,57.75 Q5.4
  pour Top (no thermals): 78.75,77.43 84.46,77.43 84.46,54.57 75.57,54.57 75.57,59.65 78.11,59.65 78.75,60.92
N$32
  Top 1.93: JP602.2 92.41,64.42 JP601.2 91.45,58.38 Q6.4
  pour Top (no thermals): 90.81,77.43 97.16,77.43 97.16,54.57 88.27,54.57 88.27,59.65 90.81,59.65
N$33
  Top 0.813: JP28.6 JP27.6
N$34
  Top 0.813: JP30.1 JP31.1
N$35
  Top 0.813: JP31.2 JP30.2
N$36
  Top 0.813: JP30.3 JP31.3
N$37
  Top 0.813: JP31.4 JP30.4
N$38
  Top 0.813: JP30.5 JP31.5
N$39
  Top 0.813: JP31.6 JP30.6
SCL
  Top 0.61: U$1.@14 U$1.14 U$1.#14 103.51,33.49 103.51,34.25 104.15,34.89 JP2.4
SDA
  Top 0.61: U$1.@13 U$1.13 U$1.#13
  Bottom 0.61: JP2.3 106.69,37.43 106.05,36.79 106.05,33.74 U$1.#13

### Text on the board
tNames: 3v3 | IoT Kitchen Lights Controller | Tinamous.com - S.Harrison | GND | V1.00